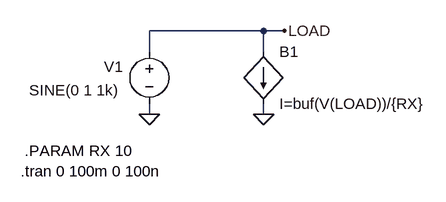
[diagram p0: schematic Loads.asc]
Loads.asc, the LTspice schematic file:
Version 4
SHEET 1 880 680
WIRE 288 96 112 96
WIRE 320 96 288 96
WIRE 112 128 112 96
WIRE 288 128 288 96
WIRE 112 224 112 208
WIRE 288 224 288 208
FLAG 112 224 0
FLAG 288 224 0
FLAG 320 96 LOAD
SYMBOL voltage 112 112 R0
WINDOW 0 -70 39 Left 2
WINDOW 3 -185 75 Left 2
WINDOW 123 -93 73 Left 2
WINDOW 39 0 0 Left 0
SYMATTR InstName V1
SYMATTR Value SINE(0 1 1k)
SYMBOL bi 288 128 R0
SYMATTR InstName B1
SYMATTR Value I=buf(V(LOAD))/{RX}
TEXT -86 312 Left 2 !.tran 0 100m 0 100n
TEXT -80 280 Left 2 !.PARAM RX 10

The netlist it stands for:
* Loads.asc
V1 LOAD 0 SINE(0 1 1k)
B1 LOAD 0 I=buf(V(LOAD))/{RX}
.tran 0 100m 0 100n
.PARAM RX 10
.backanno
.end